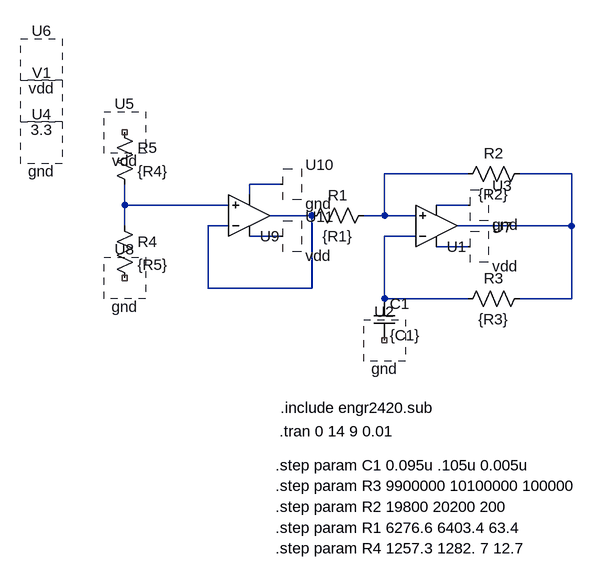
[diagram p0: schematic attempt2_validate.asc]
attempt2_validate.asc, the LTspice schematic file:
Version 4
SHEET 1 880 736
WIRE 160 144 32 144
WIRE 320 144 240 144
WIRE -128 160 -176 160
WIRE -176 176 -176 160
WIRE -368 192 -368 160
WIRE -208 192 -368 192
WIRE 160 192 112 192
WIRE -80 208 -144 208
WIRE 32 208 32 144
WIRE 32 208 0 208
WIRE 80 208 32 208
WIRE -368 224 -368 192
WIRE -208 224 -240 224
WIRE 320 224 320 144
WIRE 320 224 144 224
WIRE -128 240 -176 240
WIRE 80 240 32 240
WIRE 160 256 112 256
WIRE -240 320 -240 224
WIRE -80 320 -80 208
WIRE -80 320 -240 320
WIRE 32 336 32 240
WIRE 160 336 32 336
WIRE 320 336 320 224
WIRE 320 336 240 336
SYMBOL Opamps\\UniversalOpamp2 112 224 M180
SYMATTR InstName U1
SYMBOL cktsym\\vsource -496 32 R0
SYMATTR Value 3.3
SYMATTR InstName V1
SYMBOL res 16 192 R90
WINDOW 0 0 56 VBottom 2
WINDOW 3 32 56 VTop 2
SYMATTR InstName R1
SYMATTR Value {R1}
SYMATTR SpiceLine tol=1
SYMBOL res 256 128 R90
WINDOW 0 0 56 VBottom 2
WINDOW 3 32 56 VTop 2
SYMATTR InstName R2
SYMATTR Value {R2}
SYMATTR SpiceLine tol=1
SYMBOL res 256 320 R90
WINDOW 0 0 56 VBottom 2
WINDOW 3 32 56 VTop 2
SYMATTR InstName R3
SYMATTR Value {R3}
SYMATTR SpiceLine tol=1
SYMBOL cktsym\\gnd 160 192 R0
SYMATTR InstName U3
SYMBOL cktsym\\gnd -496 96 R0
SYMATTR InstName U4
SYMBOL cktsym\\vdd -496 -32 R0
SYMATTR InstName U6
SYMBOL cktsym\\vdd 160 256 R0
SYMATTR InstName U7
SYMBOL cap 16 336 R0
SYMATTR InstName C1
SYMATTR Value {C1}
SYMBOL cktsym\\gnd 32 400 R0
SYMATTR InstName U2
SYMBOL res -384 208 R0
SYMATTR InstName R4
SYMATTR Value {R5}
SYMATTR SpiceLine tol=1
SYMBOL res -384 64 R0
SYMATTR InstName R5
SYMATTR Value {R4}
SYMATTR SpiceLine tol=1
SYMBOL cktsym\\vdd -368 80 R0
SYMATTR InstName U5
SYMBOL cktsym\\gnd -368 304 R0
SYMATTR InstName U8
SYMBOL Opamps\\UniversalOpamp2 -176 208 M180
SYMATTR InstName U9
SYMBOL cktsym\\gnd -128 160 R0
SYMATTR InstName U10
SYMBOL cktsym\\vdd -128 240 R0
SYMATTR InstName U11
TEXT -128 504 Left 2 !.include engr2420.sub
TEXT -130 540 Left 2 !.tran 0 14 9 0.01
TEXT -136 592 Left 2 !.step param C1 0.095u .105u 0.005u
TEXT -136 624 Left 2 !.step param R3 9900000 10100000 100000
TEXT -136 656 Left 2 !.step param R2 19800 20200 200
TEXT -136 688 Left 2 !.step param R1 6276.6 6403.4 63.4
TEXT -136 720 Left 2 !.step param R4 1257.3 1282. 7 12.7

The netlist it stands for:
* attempt2_validate.asc
XU1 N001 N008 N009 N005 N002 level.2 Avol=1Meg GBW=10Meg Slew=10Meg ilimit=25m rail=0 Vos=0 phimargin=45 en=0 enk=0 in=0 ink=0 Rin=500Meg  ; pins IN+ IN- V+ V- OUT
* V1: 3.3 (symbol cktsym\vsource not available, pin order unknown); nets seen at it: 
R1 N001 N006 {R1} tol=1
R2 N002 N001 {R2} tol=1
R3 N002 N008 {R3} tol=1
* U3: gnd (symbol cktsym\gnd not available, pin order unknown); nets seen at it: N005
* U4: gnd (symbol cktsym\gnd not available, pin order unknown); nets seen at it: 
* U6: vdd (symbol cktsym\vdd not available, pin order unknown); nets seen at it: 
* U7: vdd (symbol cktsym\vdd not available, pin order unknown); nets seen at it: N009
C1 N008 NC_01 {C1}
* U2: gnd (symbol cktsym\gnd not available, pin order unknown); nets seen at it: 
R4 N004 NC_02 {R5} tol=1
R5 NC_03 N004 {R4} tol=1
* U5: vdd (symbol cktsym\vdd not available, pin order unknown); nets seen at it: 
* U8: gnd (symbol cktsym\gnd not available, pin order unknown); nets seen at it: 
XU9 N004 N006 N007 N003 N006 level.2 Avol=1Meg GBW=10Meg Slew=10Meg ilimit=25m rail=0 Vos=0 phimargin=45 en=0 enk=0 in=0 ink=0 Rin=500Meg  ; pins IN+ IN- V+ V- OUT
* U10: gnd (symbol cktsym\gnd not available, pin order unknown); nets seen at it: N003
* U11: vdd (symbol cktsym\vdd not available, pin order unknown); nets seen at it: N007
.include engr2420.sub
.tran 0 14 9 0.01
.step param C1 0.095u .105u 0.005u
.step param R3 9900000 10100000 100000
.step param R2 19800 20200 200
.step param R1 6276.6 6403.4 63.4
.step param R4 1257.3 1282. 7 12.7
.lib UniversalOpamps2.sub
.backanno
.end